# EAGLE design devBoard (EAGLE 9.6.2)
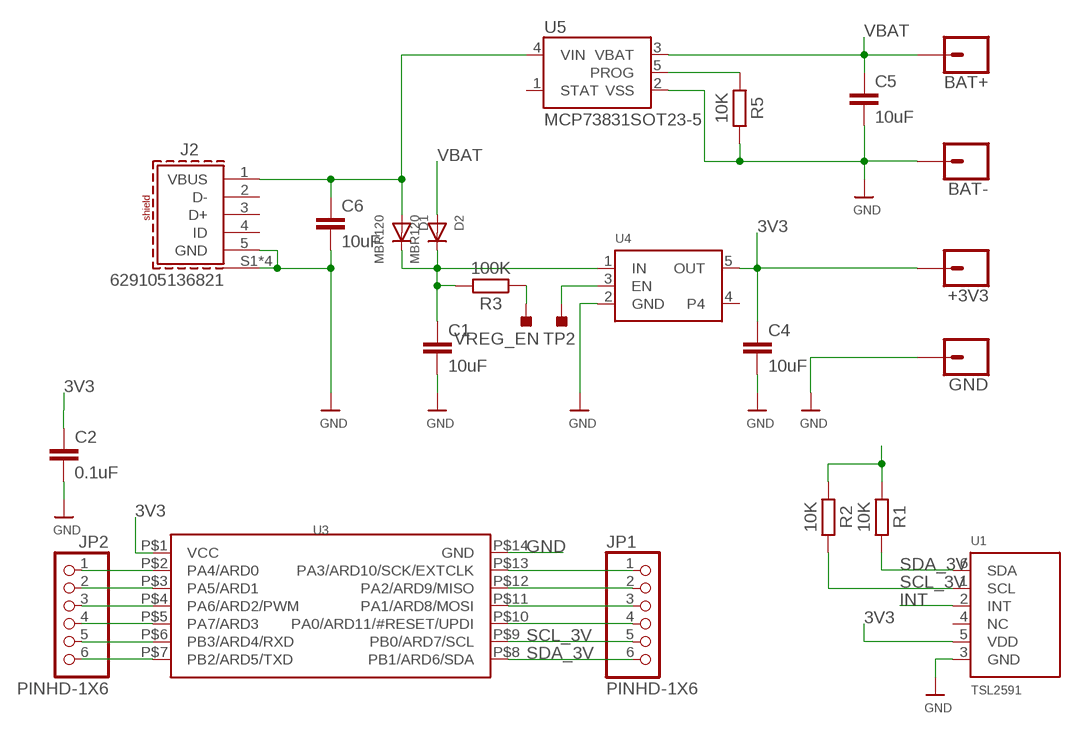
[diagram p0: schematic, sheet 1]

## Parts
+3V3  CONN_01  [1X01]
BAT+  CONN_01  [1X01]
BAT-  CONN_01  [1X01]
C1  10uF  10UF-0603-6.3V-20%  [0603]
C2  0.1uF  0.1UF-0603-25V-5%  [0603]
C4  10uF  10UF-0603-6.3V-20%  [0603]
C5  10uF  10UF-0603-6.3V-20%  [0603]
C6  10uF  10UF-0603-6.3V-20%  [0603]
D1  MBR120  DIODESOD-123  [SOD-123]
D2  MBR120  DIODESOD-123  [SOD-123]
GND  CONN_01  [1X01]
J2  629105136821  [629105136821]
JP1  PINHD-1X6  [1X06]
JP2  PINHD-1X6  [1X06]
R1  10K  R_CHIP-0603(1608-METRIC)  [RESC1608X60]
R2  10K  R_CHIP-0603(1608-METRIC)  [RESC1608X60]
R3  100K  R_CHIP-0603(1608-METRIC)  [RESC1608X60]
R5  10K  R_CHIP-0603(1608-METRIC)  [RESC1608X60]
TP2  TESTPOINT_TPS-PAD-036  [TESTPOINT_PAD-036]
U1  TSL2591  LIGHT_TSL2591  [DFN6_TAOS]
U3  ATTINY1604  [SOIC150]
U4  VREG_SOT23-5  [SOT23-5:1]
U5  MCP73831SOT23-5  [SOT95P280X110-5]
VREG_EN  TESTPOINT_TPS-PAD-036  [TESTPOINT_PAD-036]

## Nets
3V3: +3V3.1 C2.1 C4.1 R1.1 R2.1 U1.5(VDD) U3.P$1(VCC) U4.5(OUT)
GND: BAT-.1 C1.2 C2.2 C4.2 C5.2 C6.2 GND.1 J2.5(GND) J2.S1(SHIELD) J2.S2(SHIELD) J2.S3(SHIELD) J2.S4(SHIELD) R5.2 U1.3(GND) U3.P$14(GND) U4.2(GND) U5.2(VSS)
INT: U1.2(INT)
N$1: C1.1 D1.C D2.C R3.2 U4.1(IN)
N$2: JP2.1 U3.P$2(PA4/ARD0)
N$3: JP2.2 U3.P$3(PA5/ARD1)
N$4: R5.1 U5.5(PROG)
N$5: JP2.3 U3.P$4(PA6/ARD2/PWM)
N$6: JP2.4 U3.P$5(PA7/ARD3)
N$7: JP2.5 U3.P$6(PB3/ARD4/RXD)
N$8: JP2.6 U3.P$7(PB2/ARD5/TXD)
N$9: JP1.4 U3.P$10(PA0/ARD11/#RESET/UPDI)
N$10: JP1.3 U3.P$11(PA1/ARD8/MOSI)
N$11: JP1.2 U3.P$12(PA2/ARD9/MISO)
N$12: JP1.1 U3.P$13(PA3/ARD10/SCK/EXTCLK)
N$13: R3.1 VREG_EN.1(TP)
N$14: TP2.1(TP) U4.3(EN)
SCL_3V: JP1.5 R2.2 U1.1(SCL) U3.P$9(PB0/ARD7/SCL)
SDA_3V: JP1.6 R1.2 U1.6(SDA) U3.P$8(PB1/ARD6/SDA)
VBAT: BAT+.1 C5.1 D2.A U5.3(VBAT)
VBUS: C6.1 D1.A J2.1(VBUS) U5.4(VIN)
Unconnected: J2.2(D-) J2.3(D+) J2.4(ID) U1.4(NC) U4.4 U5.1(STAT)

## Library data of the parts
+3V3 BAT+ BAT- GND = SparkFun-Connectors:CONN_01: Single connection point. Often used as Generic Header-pin footprint for 0.1 inch spaced/style header connections On any of the 0.1 inch spaced packages, you can populate with these: Break Away Headers - Straight <https://www.sparkfun.com/products/116> (PRT-00116) Break Away Male Headers - Right Angle <https://www.sparkfun.com/products/553> (PRT-00553) Female Headers <https://www.sparkfun.com/products/115> (PRT-00115) Break Away Headers - Machine Pin <https://www.sparkfun.com/products/117> (PRT-00117) Break Away Female Headers - Swiss Machine Pin <https://www.sparkfun.com/products/743> (PRT-00743) This device is also useful as a general connection point to wire up your design to another part of your project. Our various solder wires solder well into these plated through hole pads. Hook-Up Wire - Assortment (Stranded, 22 AWG) <https://www.sparkfun.com/products/11375> (PRT-11375) Hook-Up Wire - Assortment (Solid Core, 22 AWG) <https://www.sparkfun.com/products/11367> (PRT-11367) View the entire wire category on our website here <https://www.sparkfun.com/categories/141> Special notes: SMTSO-256-ET is a "flush mount" nut for a 4-40 screw. We mostly use this on specialty testbeds; it is a nice way to connect hardware to your PCB at an adjustable hieght. Also note, the SNAP packages are for using a snappable style connector. We sell a baggie of snaps and they are also used on two LilyPad designs: Snap Assortment - 30 pack (male and female) <https://www.sparkfun.com/products/11347> (DEV-11347) LilyPad Arduino SimpleSnap <https://www.sparkfun.com/products/10941> (DEV-10941) LilyPad SimpleSnap Protoboard <https://www.sparkfun.com/products/10940> (DEV-10940)
C1 C4-C6 = SparkFun-Capacitors:10UF: 10.0µF ceramic capacitors A capacitor is a passive two-terminal electrical component used to store electrical energy temporarily in an electric field.; PROD_ID: CAP-11015
C2 = SparkFun-Capacitors:0.1UF: 0.1µF ceramic capacitors A capacitor is a passive two-terminal electrical component used to store electrical energy temporarily in an electric field.; PROD_ID: CAP-08604
D1 D2 = adafruit:DIODE: Diode SMADIODE - SMA Surface Mount Package 20V 1A Schottky Diode Digikey: 641-1014-6-ND DO-1N4148 - Through Hole Small Current Diode SOD-123 20V 1 A (.5mV Vf) Schottky Diode - Digikey: MBRX120TPMSCT-ND SOD-323 10V 570mA (.38mV Vf, 3ns) Schottky Diode - Digikey: ZLLS410CT-ND SOD-523 30V 30mA Schottky Diode (RB751S-40TE61) - Digikey: RB751S-40TE61CT-ND SOT23-R/W - SOT23 Package (R = Solder Paste/Reflow Ovens, W = Hand-Soldering) BAT54Film 40V 300mA - Digikey: 497-7162-1-ND
J2 = Wurth_Connectors_WR-USB:629105136821: WR-COM Micro USB 2.0 SMT Type B Horizontal 5 Contacts Kind Properties Durability:10 000 Mating cycles Quality Class:10 000 Mating cycles Connector Type:Micro USB Gender:Receptacle Type:Horizontal General Information Operating Temperature:-40up to +105 °C Compliance:RoHS Electrical Properties IR 1:1A Working Voltage:30V (AC) Withstanding Voltage:100V (AC) Contact Resistance:30 mΩ Material Properties Insulator Material:LCP Insulator Flammability Rating:UL94 V-0 Color:Black Contact Material:Copper Alloy Contact Plating: Gold Contact Type:Stamped Shielding Material:Stainless Steel Shielding Plating:Nickel <https://www.we-online.com/catalog/media/o32999v209%20Family_WR-COM_629105136821.jpg> Details see: https://www.we-online.com/catalog/en/COM_MICRO_SMT_TYPE_B_HORIZONTAL/ Updated by Yingchun, Shan 2020-01-16 2020 (C) Würth Elektronik; APPLICATION: Micro USB 2.0; DATASHEET-URL: https://www.we-online.com/catalog/datasheet/629105136821.pdf; GERDER: Receptacle; INTERFACE-TYPE: Type B; IR1: 1.0A; MOUNT: SMT; PACKAGING: Tape and Reel; PART-NUMBER: 629105136821; PINS: 5; TYPE: Horizontal; WORKING-VOLTAGE: 30V(AC)
JP1 JP2 = Connector:PINHD-1X6: PIN HEADER; CATEGORY: CONNECTOR; SUB-CATEGORY: PIN-HEADER
R1-R3 R5 = Resistor:R: Resistor Fixed - Generic; CATEGORY: Resistor; SUB-CATEGORY: Fixed
TP2 VREG_EN = 52101-101-REV-A_v16:TESTPOINT_TPS: TEST POINT PAD; BOM: EXCLUDE
U1 = microbuilder:LIGHT_TSL2591: TSL2591 Light-To-Digital Sensor
U3 = attiny1604:ATTINY1604: The ATtiny804/1604 microcontrollers are using the high-performance, low-power AVR® RISC architecture,and are capable of running at up to 20 MHz, with up to 8/16 KB Flash, 512/1024 bytes of SRAM, and128/256 bytes of EEPROM in a 14-pin package. The series uses the latest technologies with a flexibleand low-power architecture including Event System and SleepWalking, accurate analog features andadvanced peripherals.
U4 = Airquality_Sensor:VREG_SOT23-5: SOT23-5 Fixed Voltage Regulators Part Current Out V Out V In V Dropout θJA (°C/W) TJ (°C) Digikey Part No. ADP121 150mA 3.3V 3.4-5.5V 0.09V @ 150mA -- -- ADP121-AUJZ33R7CT-ND ADP121 150mA 3.0V 3.1-5.5V 0.09V @ 150mA -- -- ADP121-AUJZ30R7CT-ND ADP122 300mA 3.3V 3.4-5.5V 0.085V @ 300mA -- -- ADP122AUJZ-3.3-R7CT-ND ADP1712 300mA 3.3V 3.5-5.5V 0.17V @ 300mA -- -- ADP1712AUJZ-3.3-R7TR-ND AP7311 (Low Cost) 150mA 3.3V 3.5-6V 0.15V @ 150mA -- -- AP7311-33WG-7DICT-ND LD39015M18R 150mA 1.8V 1.9V-5.5V 0.08V @ 100mA -- -- 497-6977-1-ND LP2985A-33DBVR 150mA 3.3V 3.3-16V 0.28V @ 150mA 206 150 296-18479-1-ND MCP1824T-3302E/OT 300mA 3.3V 3.5V-6V 0.2V @ 300mA -- -- MCP1824T-3302E/OTCT-ND MIC5205-2.5YM5 TR 150mA 2.5V 2.7-16V 0.165V @ 150mA -- -- 576-1257-2-ND MIC5205-3.0YM5 TR 150mA 3.0V 3.2V-16V 0.165V @ 150mA -- -- 576-1258-2-ND MIC5205-3.3YM5 TR 150mA 3.3V 3.5V-16V 0.165V @ 150mA -- -- 576-1259-2-ND TPS780330220 150mA 3.3V+2.2V 3.6-5.5V 250mV Max -- -- 296-23332-1-ND TDA3663/N1,135 100mA 3.3V 3.5-45V 0.18V @ 50mA -- -- 568-5343-1-ND Max operating temp can be calculated using θJA, TJ (max junction temperature), and power in watts. Set the "Maximum Ambient Temperature" until it reaches TJ ("Max Junction Temperature"), which is the absolute limit for safe use of the regulator: Heat Sink Temperature Calculator <http://www.daycounter.com/Calculators/Heat-Sink-Temperature-Calculator.phtml> For example, With 12V source into a 3.3V LP2985 and a 30mA load, we are dissipating (12V-3.3V) * 0.03A = 0.261W. With a θJA of 206 °C/W, a TJ of 150°C, and 261mW we can safely use the chip without a heat sink up to 75°C (=147.1°C Junction Temperature).
U5 = Airquality_Sensor:MCP73831: Miniature single cell, fully integrated Li-Ion, Li-polymer charge management controller http://ww1.microchip.com/downloads/en/DeviceDoc/21984a.pdf IC-09995; PROD_ID: IC-09995

## Board
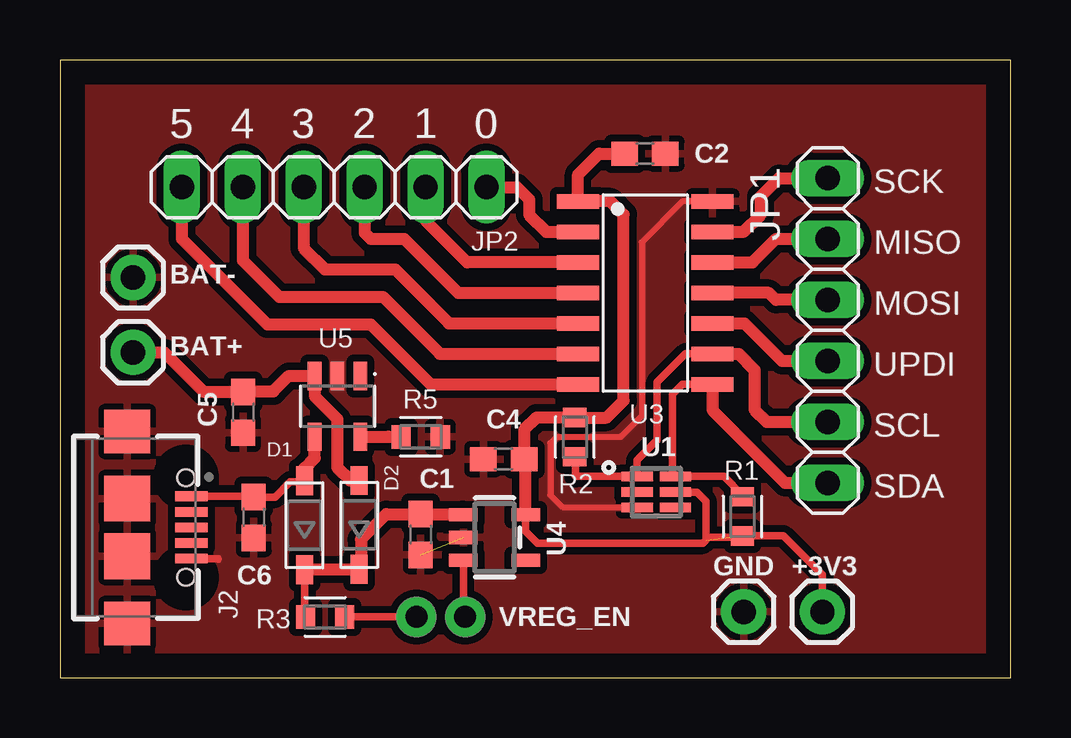
[diagram p1: board, top side]

Size 39.63 x 25.75 mm. Coordinates in mm from the lower left corner, seen from the top.
Outline: 0,0 39.63,0 39.63,25.75 0,25.75 0,0
Copper layers (1*16): Top 0.035mm / dielectric 1.5mm / Bottom 0.035mm
Design rules "default": minimum track width 6mil, minimum drill 0.35mm, track to track 6mil, track to pad 6mil, pad to pad 6mil, via to via 6mil, smd to smd 6mil, copper to edge 40mil, drill to drill 6mil, minimum pad ring 10mil, minimum via ring 8mil, stop-mask expansion 4mil, vias tented up to drill 0mil, thermal gap 10mil

### Footprints (pad centres in the part's own frame; a part is rotated, then mirrored left to right if it is on the bottom)
1X01 = drill 1.016 pad 1.88: 1 0,0
0603 = smd 1.1 x 1: 1 -0.85,0; 2 0.85,0
SOD-123 = smd 1.2 x 0.7: A 1.85,0; C -1.85,0
629105136821 = smd 0.4 x 1.35: 1 -1.3,2.325; 2 -0.65,2.325; 3 0,2.325; 4 0.65,2.325; 5 1.3,2.325 | smd 1.8 x 1.9: S1 -4,-0.35; S4 4,-0.35 | smd 1.9 x 1.9: S2 -1.2,-0.35; S3 1.2,-0.35 | hole 0.7: -2.075,2.1; 2.075,2.1
1X06 = drill 1.016 long: 1 -6.35,0; 2 -3.81,0; 3 -1.27,0; 4 1.27,0; 5 3.81,0; 6 6.35,0
RESC1608X60 = smd 0.799 x 0.974: 1 -0.815,0; 2 0.815,0
TESTPOINT_PAD-036 = drill 0.914 pad 1.676: 1 0,0
DFN6_TAOS = smd 1.3 x 0.4: 1 -0.8,0.65; 2 -0.8,0; 3 -0.8,-0.65; 4 0.8,-0.65; 5 0.8,0; 6 0.8,0.65
SOIC150 = smd 0.6 x 1.75: P$1 -3.81,-2.8; P$2 -2.54,-2.8; P$3 -1.27,-2.8; P$4 0,-2.8; P$5 1.27,-2.8; P$6 2.54,-2.8; P$7 3.81,-2.8; P$8 3.81,2.8; P$9 2.54,2.8; P$10 1.27,2.8; P$11 0,2.8; P$12 -1.27,2.8; P$13 -2.54,2.8; P$14 -3.81,2.8
SOT23-5:1 = smd 0.55 x 1.2: 1 -0.95,-1.3; 2 0,-1.3; 3 0.95,-1.3; 4 0.95,1.3; 5 -0.95,1.3
SOT95P280X110-5 = smd 1.179 x 0.572: 1 -1.264,0.95; 2 -1.264,0; 3 -1.264,-0.95; 4 1.264,-0.95; 5 1.264,0.95

### Placement (x,y rotation side)
+3V3  31.78,2.75 0 top
BAT+  3.05,13.56 0 top
BAT-  3.05,16.68 0 top
C1  15.04,5.98 270 top
C2  24.38,21.84 0 top
C4  18.5,9.12 180 top
C5  7.63,11.07 270 top
C6  8.08,6.69 270 top
D1  10.19,6.36 90 top
D2  12.47,6.38 90 top
GND  28.5,2.75 0 top
J2  3.15,6.27 270 top
JP1  32,14.48 270 top
JP2  11.43,20.45 180 top
R1  28.45,6.73 90 top
R2  21.46,10.03 270 top
R3  11.05,2.54 180 top
R5  15.04,10.04 0 top
TP2  16.89,2.54 0 top
U1  24.86,7.74 0 top
U3  24.4,16.04 270 top
U4  18.11,5.85 270 top
U5  11.57,11.32 270 top
VREG_EN  14.86,2.54 0 top

### Tracks (layer width: path | path; a pad name or v marks a point on that pad's centre or on a via)
3V3  (1 unrouted)
  Top 0.305: U1.5 26.55,7.74 26.92,7.37 26.92,5.87 28.4,5.87 R1.1 30.15,5.92 31.78,4.29 +3V3.1 | U4.5 19.41,6.11 19.91,5.62 26.8,5.62 26.92,5.74
  Top 0.508: U4.5 19.41,9.05 C4.1 19.35,10.33 19.86,10.85 R2.1 22.79,10.85 23.5,11.56 23.5,19.3 22.95,19.85 U3.P$1 21.6,20.96 22.48,21.84 C2.1
GND  (1 unrouted)
  Top 0.254: U3.P$14 25.95,19.85 24.26,18.16 24.26,10.92 23.37,10.03 20.7,10.03 20.45,9.78 20.45,7.62 20.95,7.11 24.04,7.11 U1.3
  Top 0.305: J2.5 6.59,4.97 6.6,4.95
  pour Top (isolate 0.305): -0.76,27.05 40.13,27.05 40.13,-1.14 -0.89,-1.14 -0.89,26.92
N$1
  Top 0.152: D2.C 12.46,4.51 | 12.59,4.26 12.55,4.22
  Top 0.305: D1.C 10.19,2.58 R3.2
  Top 0.508: 12.46,4.51 D1.C | 12.55,4.46 12.55,5.78 13.6,6.83 C1.1 16.79,6.83 U4.1 | D2.C 12.55,4.46 | 12.55,4.46 12.55,4.22
N$2
  Top 0.508: JP2.1 19.05,20.45 19.56,19.94 19.56,19.3 20.28,18.58 U3.P$2
N$3
  Top 0.508: U3.P$3 16.98,17.31 15.24,19.05 JP2.2
N$4
  Top 0.152: 12.57,10.1 U5.5
  Top 0.508: U5.5 13.7,10.05 13.71,10.04 R5.1
N$5
  Top 0.508: JP2.3 12.7,18.54 12.95,18.29 14.35,18.29 16.6,16.04 U3.P$4
N$6
  Top 0.508: JP2.4 10.16,17.91 11.05,17.02 13.97,17.02 16.22,14.77 U3.P$5
N$7
  Top 0.508: JP2.5 7.62,17.4 9.14,15.88 13.46,15.88 15.84,13.5 U3.P$6
N$8
  Top 0.508: JP2.6 5.08,18.29 8.64,14.73 12.95,14.73 15.46,12.23 U3.P$7
N$9
  Top 0.508: U3.P$10 28.54,14.77 30.1,13.21 JP1.4
N$10
  Top 0.508: JP1.3 29.84,15.75 29.55,16.04 U3.P$11
N$11
  Top 0.508: U3.P$12 28.87,17.31 29.84,18.29 JP1.2
N$12
  Top 0.508: U3.P$13 28.49,18.58 29.21,19.3 29.21,20.07 29.97,20.83 JP1.1
N$13
  Top 0.305: R3.1 VREG_EN.1
N$14
  Top 0.305: TP2.1 16.81,2.62 U4.3
SCL_3V
  Top 0.305: U3.P$9 26.07,13.5 24.89,12.32 24.89,9.91 24.06,9.08 U1.1 21.48,8.39 R2.2
  Top 0.508: U3.P$9 28.28,13.5 28.96,12.83 28.96,11.18 29.46,10.67 JP1.5
SDA_3V
  Top 0.305: U3.P$8 25.95,12.23 25.53,11.81 25.53,8.53 U1.6 27.68,8.39 28.45,7.62 R1.2
  Top 0.508: U3.P$8 27.2,11.15 30.23,8.13 JP1.6
VBAT
  Top 0.152: 10.62,12.76 U5.3 | C5.1 7.63,12.04
  Top 0.508: D2.A 12.09,8.23 11.56,8.76 11.56,10.79 10.62,11.74 U5.3 9.53,12.58 8.89,11.94 7.65,11.94 C5.1 5.99,11.92 4.34,13.56 BAT+.1
VBUS
  Top 0.152: 10.15,8.17 D1.A
  Top 0.305: J2.1 8.05,7.57 C6.1 8.97,7.54 9.6,8.17 10.15,8.17
  Top 0.508: U5.4 10.62,9.16 10.19,8.74 D1.A

### Text on the board
tNames: 5 | 4 | 3 | 2 | 1 | 0 | SCK | MISO | MOSI | UPDI | SCL | SDA